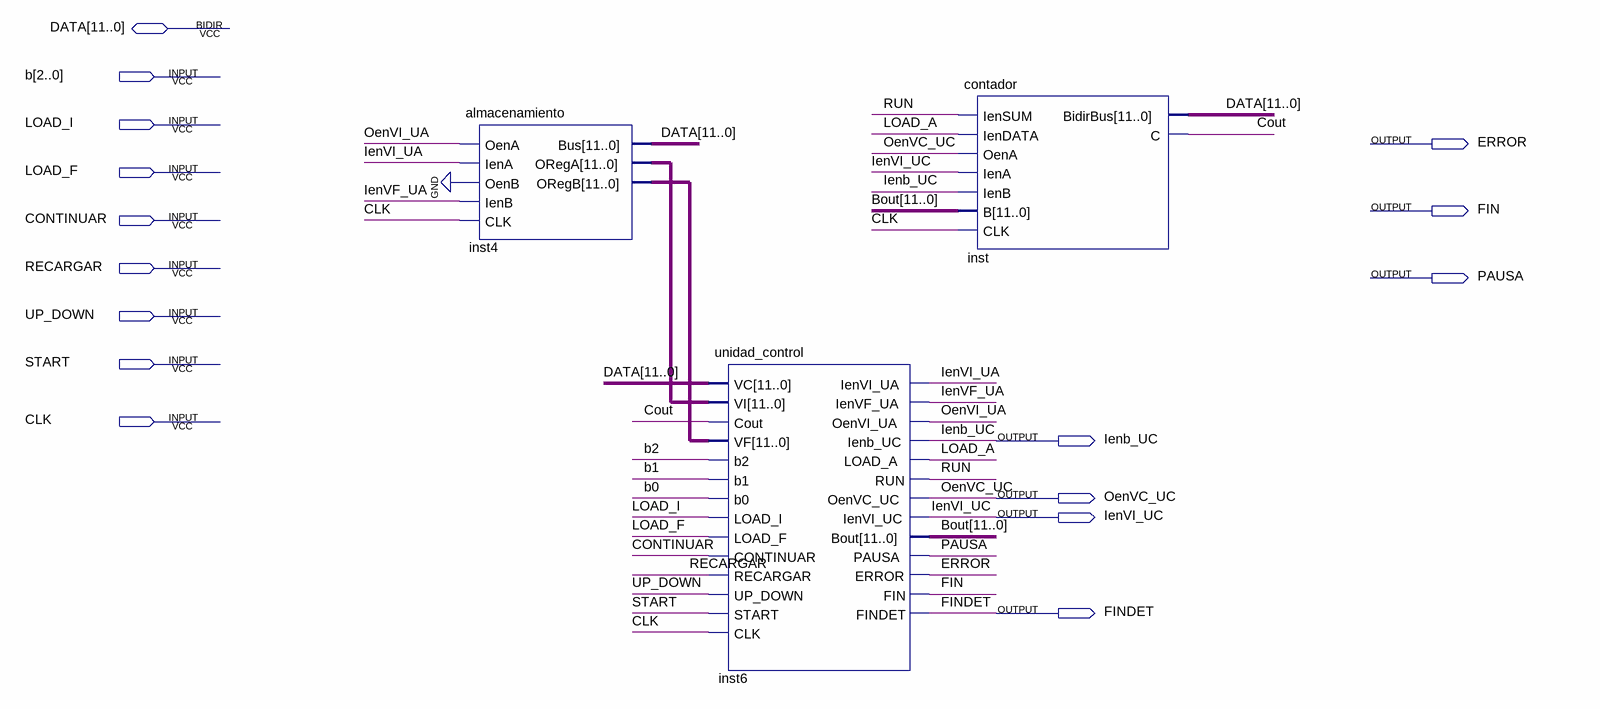
[diagram p0: schematic sheet]
// Quartus schematic circuito_principal.bdf as structural Verilog: 3 symbols, 16 pins
module circuito_principal (
  input  [2:0] b,
  input  LOAD_I,
  input  LOAD_F,
  input  CONTINUAR,
  input  RECARGAR,
  input  UP_DOWN,
  input  START,
  input  CLK,
  inout  [11:0] DATA,
  output ERROR,
  output FIN,
  output PAUSA,
  output Ienb_UC,
  output OenVC_UC,
  output IenVI_UC,
  output FINDET
);

  wire Cout, IenVF_UA, IenVI_UA, LOAD_A, OenVI_UA, RUN;
  wire [11:0] Bout, inst4_orega, inst4_oregb;

  almacenamiento inst4 (
    .OenA(OenVI_UA), .IenA(IenVI_UA), .OenB(1'b0), .IenB(IenVF_UA), .CLK(CLK), .ORegA(inst4_orega),
    .ORegB(inst4_oregb), .Bus(DATA));
  unidad_control inst6 (
    .VC(DATA), .VI(inst4_orega), .Cout(Cout), .VF(inst4_oregb), .b2(b[2]), .b1(b[1]), .b0(b[0]),
    .LOAD_I(LOAD_I), .LOAD_F(LOAD_F), .CONTINUAR(CONTINUAR), .RECARGAR(RECARGAR), .UP_DOWN(UP_DOWN),
    .START(START), .CLK(CLK), .IenVI_UA(IenVI_UA), .IenVF_UA(IenVF_UA), .OenVI_UA(OenVI_UA),
    .Ienb_UC(Ienb_UC), .LOAD_A(LOAD_A), .RUN(RUN), .OenVC_UC(OenVC_UC), .IenVI_UC(IenVI_UC), .Bout(Bout),
    .PAUSA(PAUSA), .ERROR(ERROR), .FIN(FIN), .FINDET(FINDET));
  contador inst (
    .IenSUM(RUN), .IenDATA(LOAD_A), .OenA(OenVC_UC), .IenA(IenVI_UC), .IenB(Ienb_UC), .B(Bout), .CLK(CLK),
    .C(Cout), .BidirBus(DATA));
endmodule
